# EAGLE schematic Daughter Card v7 (EAGLE 7.7.0)
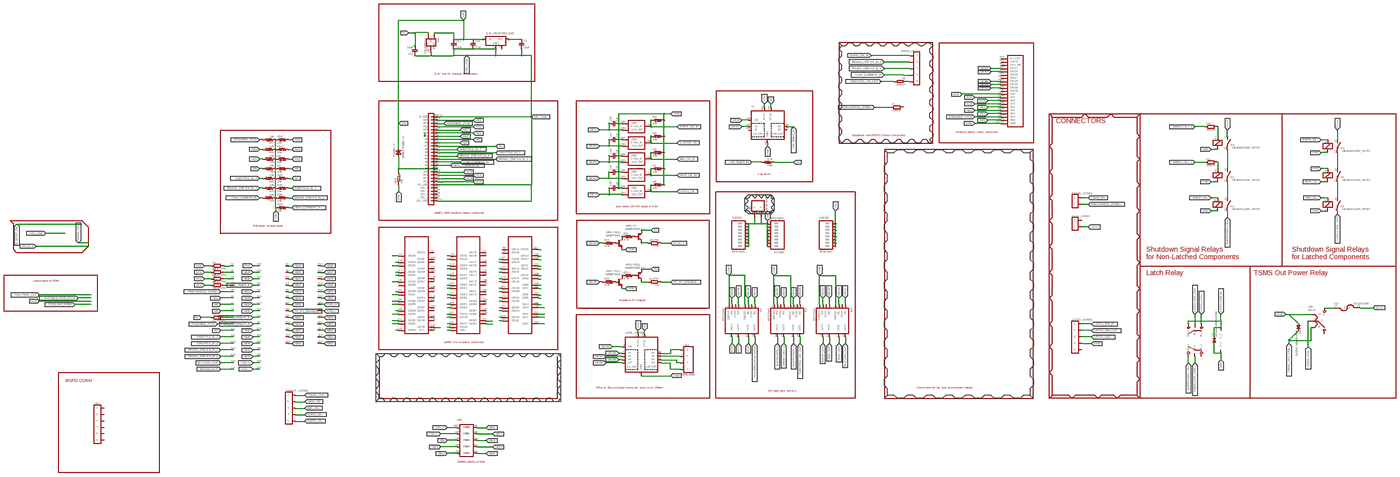
[diagram p0: schematic, sheet 1, overview]
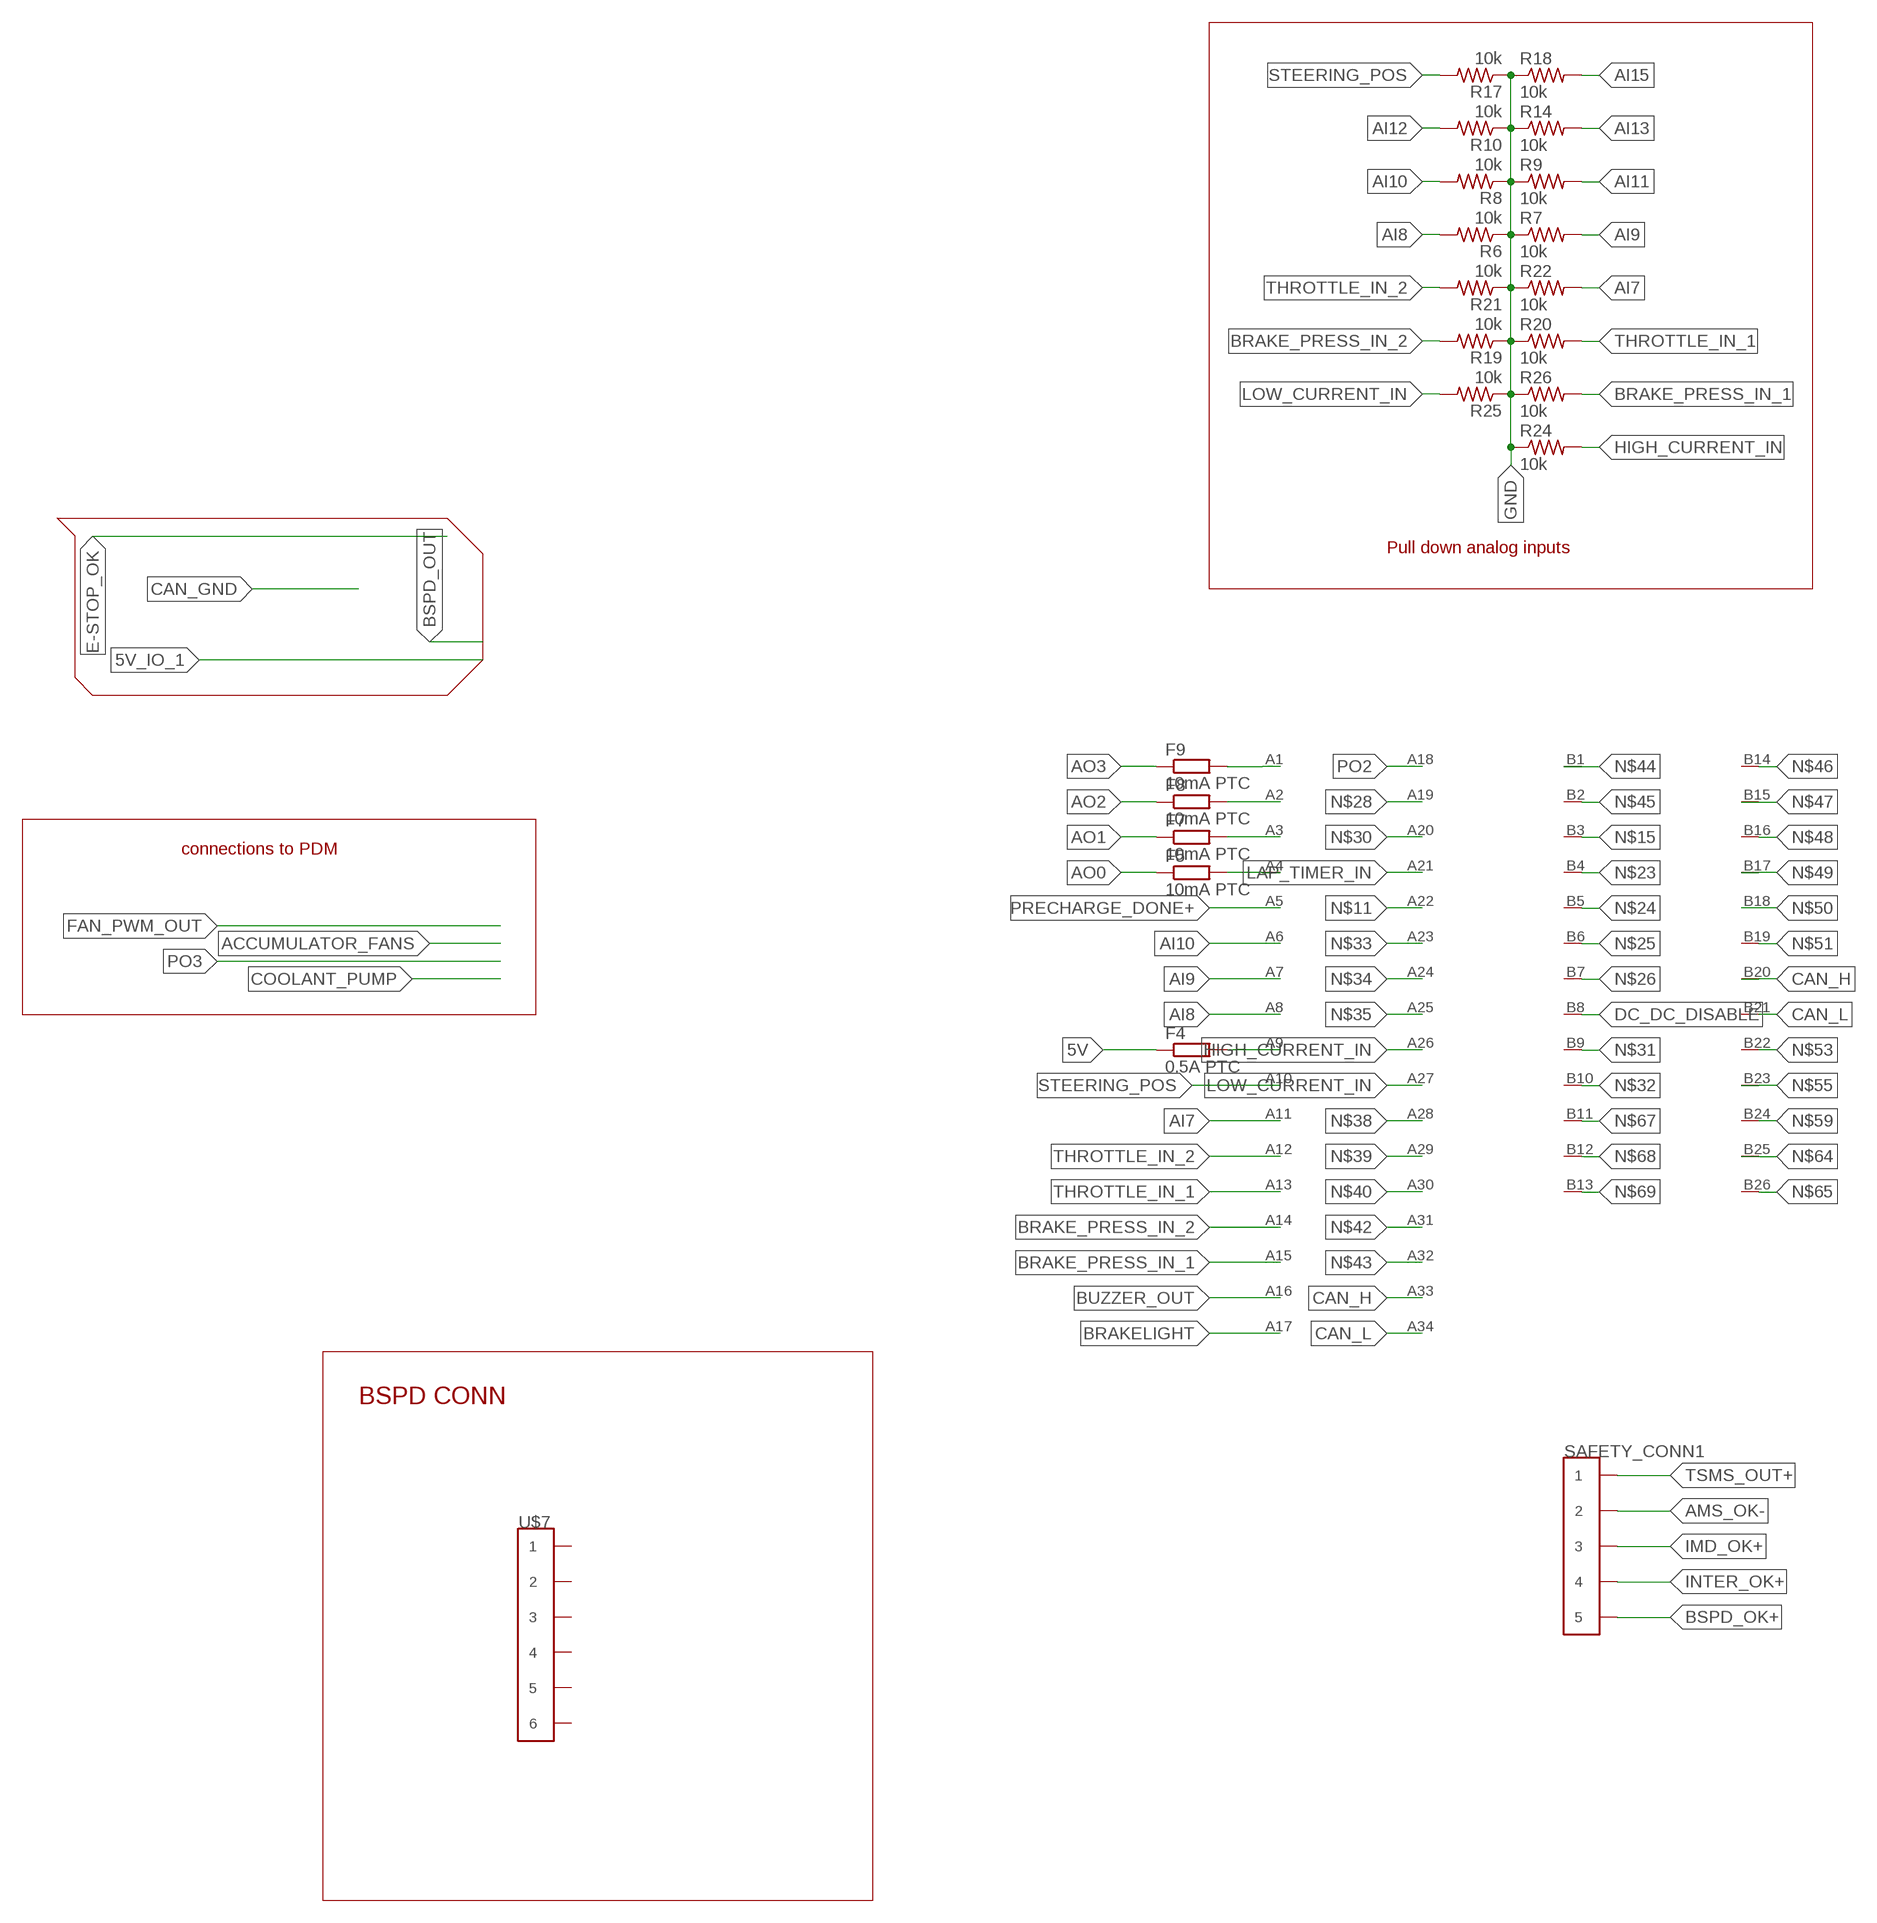
[diagram p1: schematic, sheet 1, part 1 of 4]
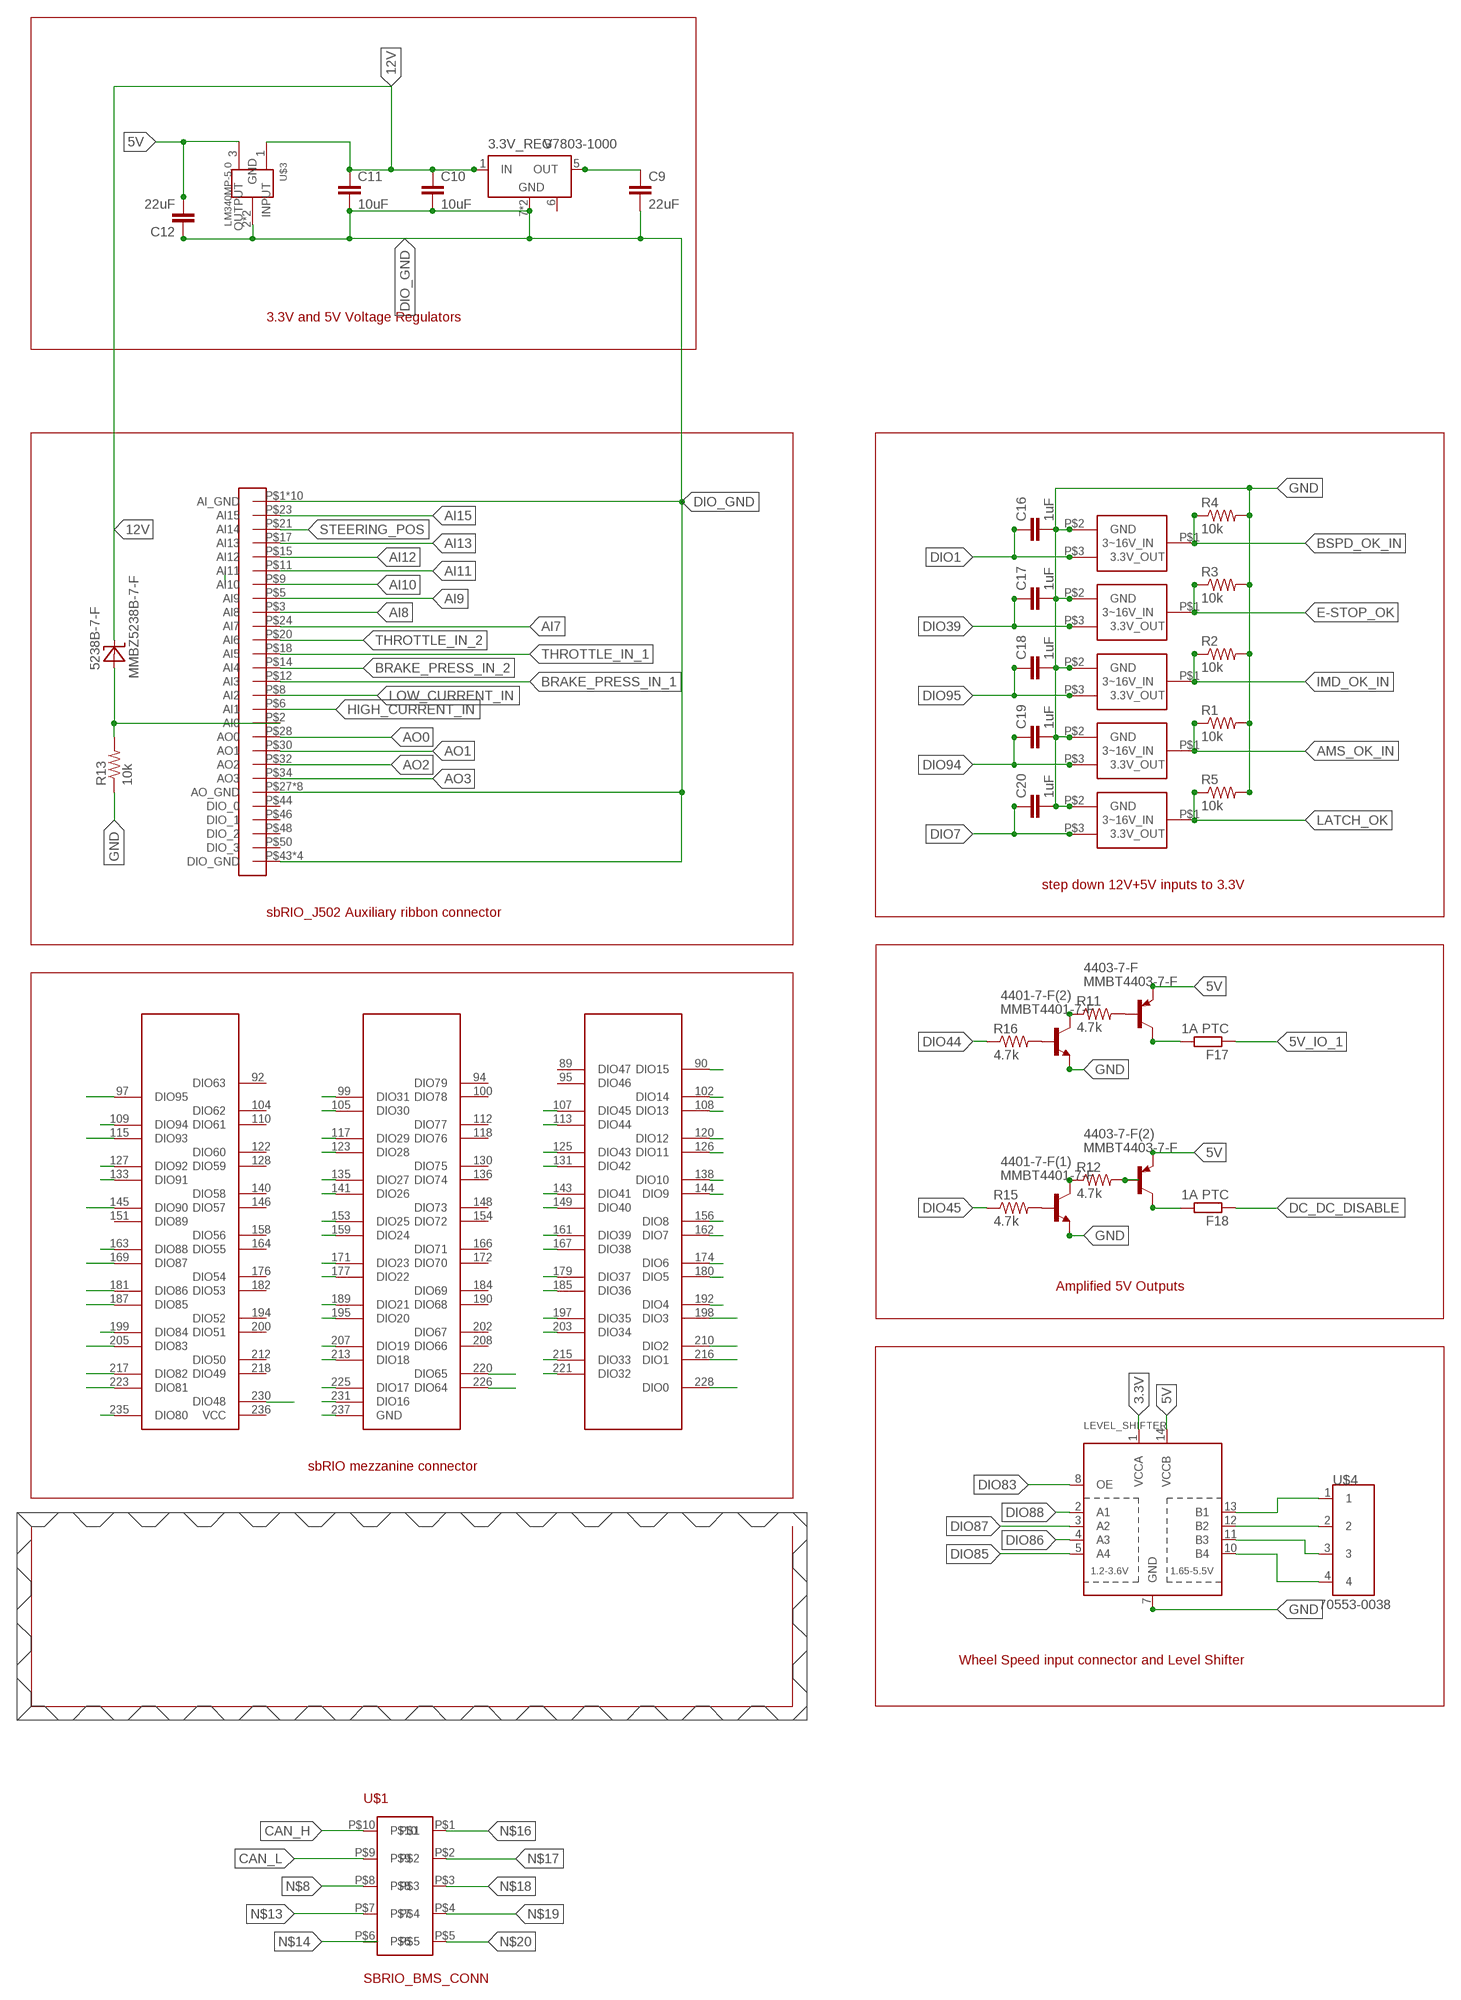
[diagram p2: schematic, sheet 1, part 2 of 4]
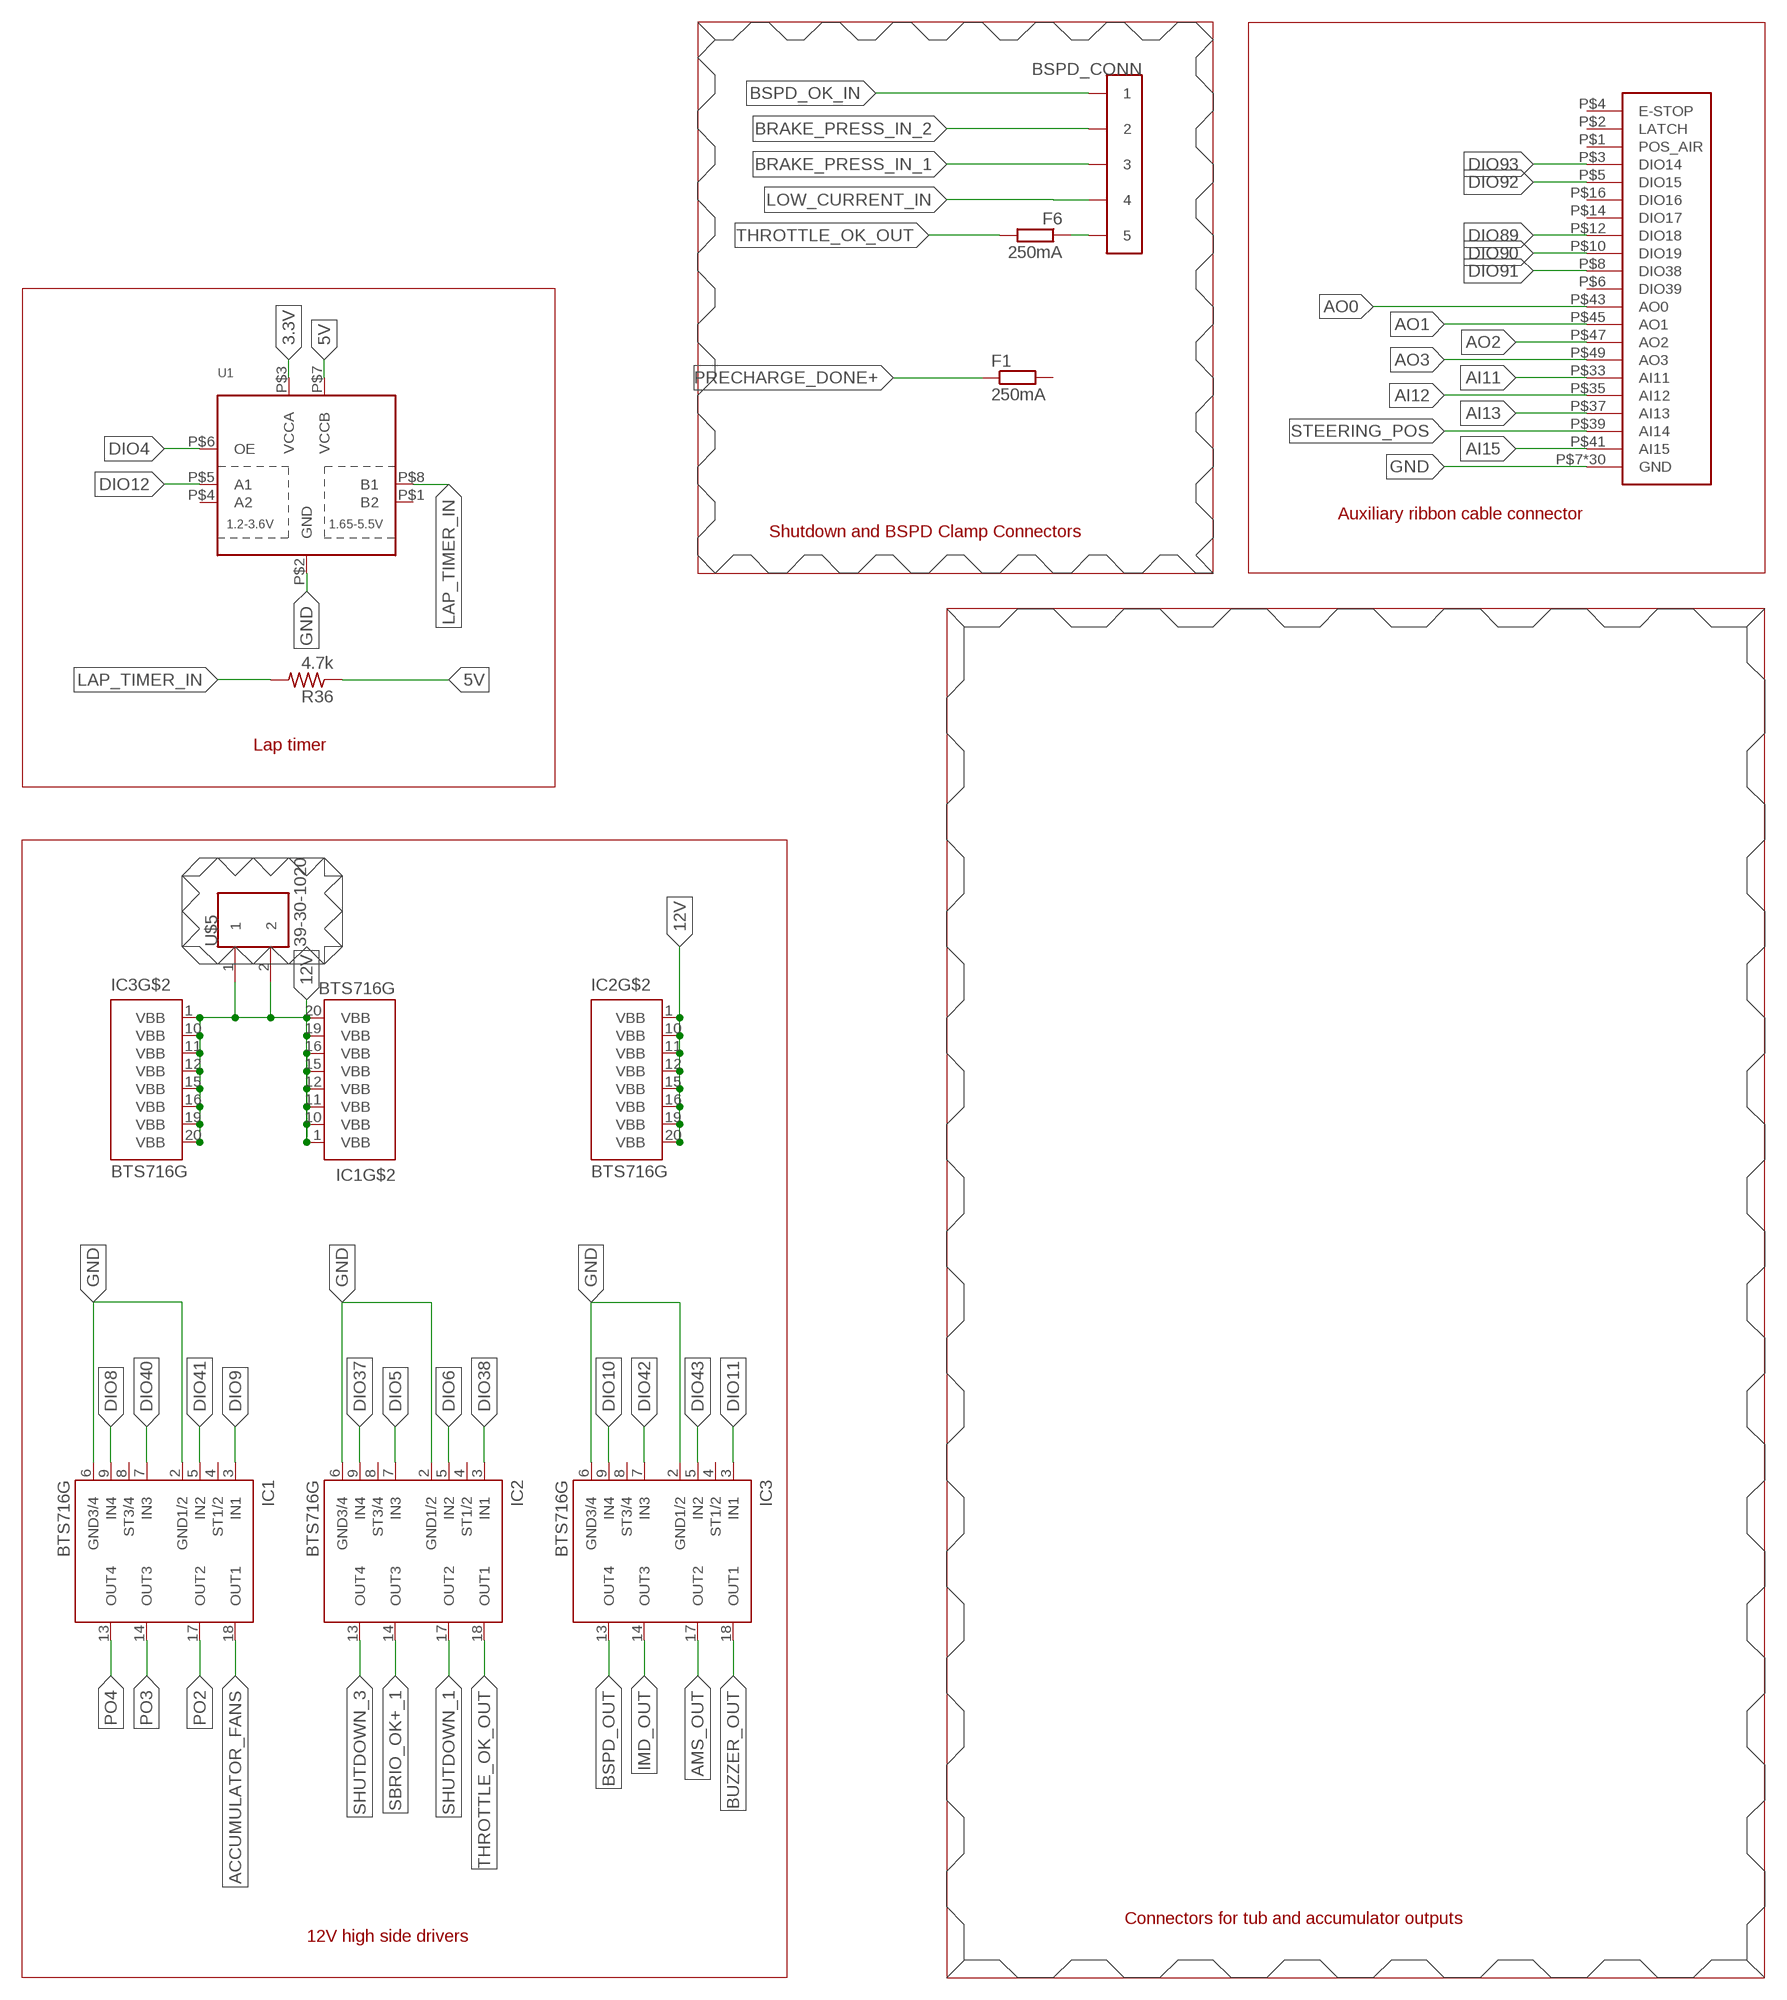
[diagram p3: schematic, sheet 1, part 3 of 4]
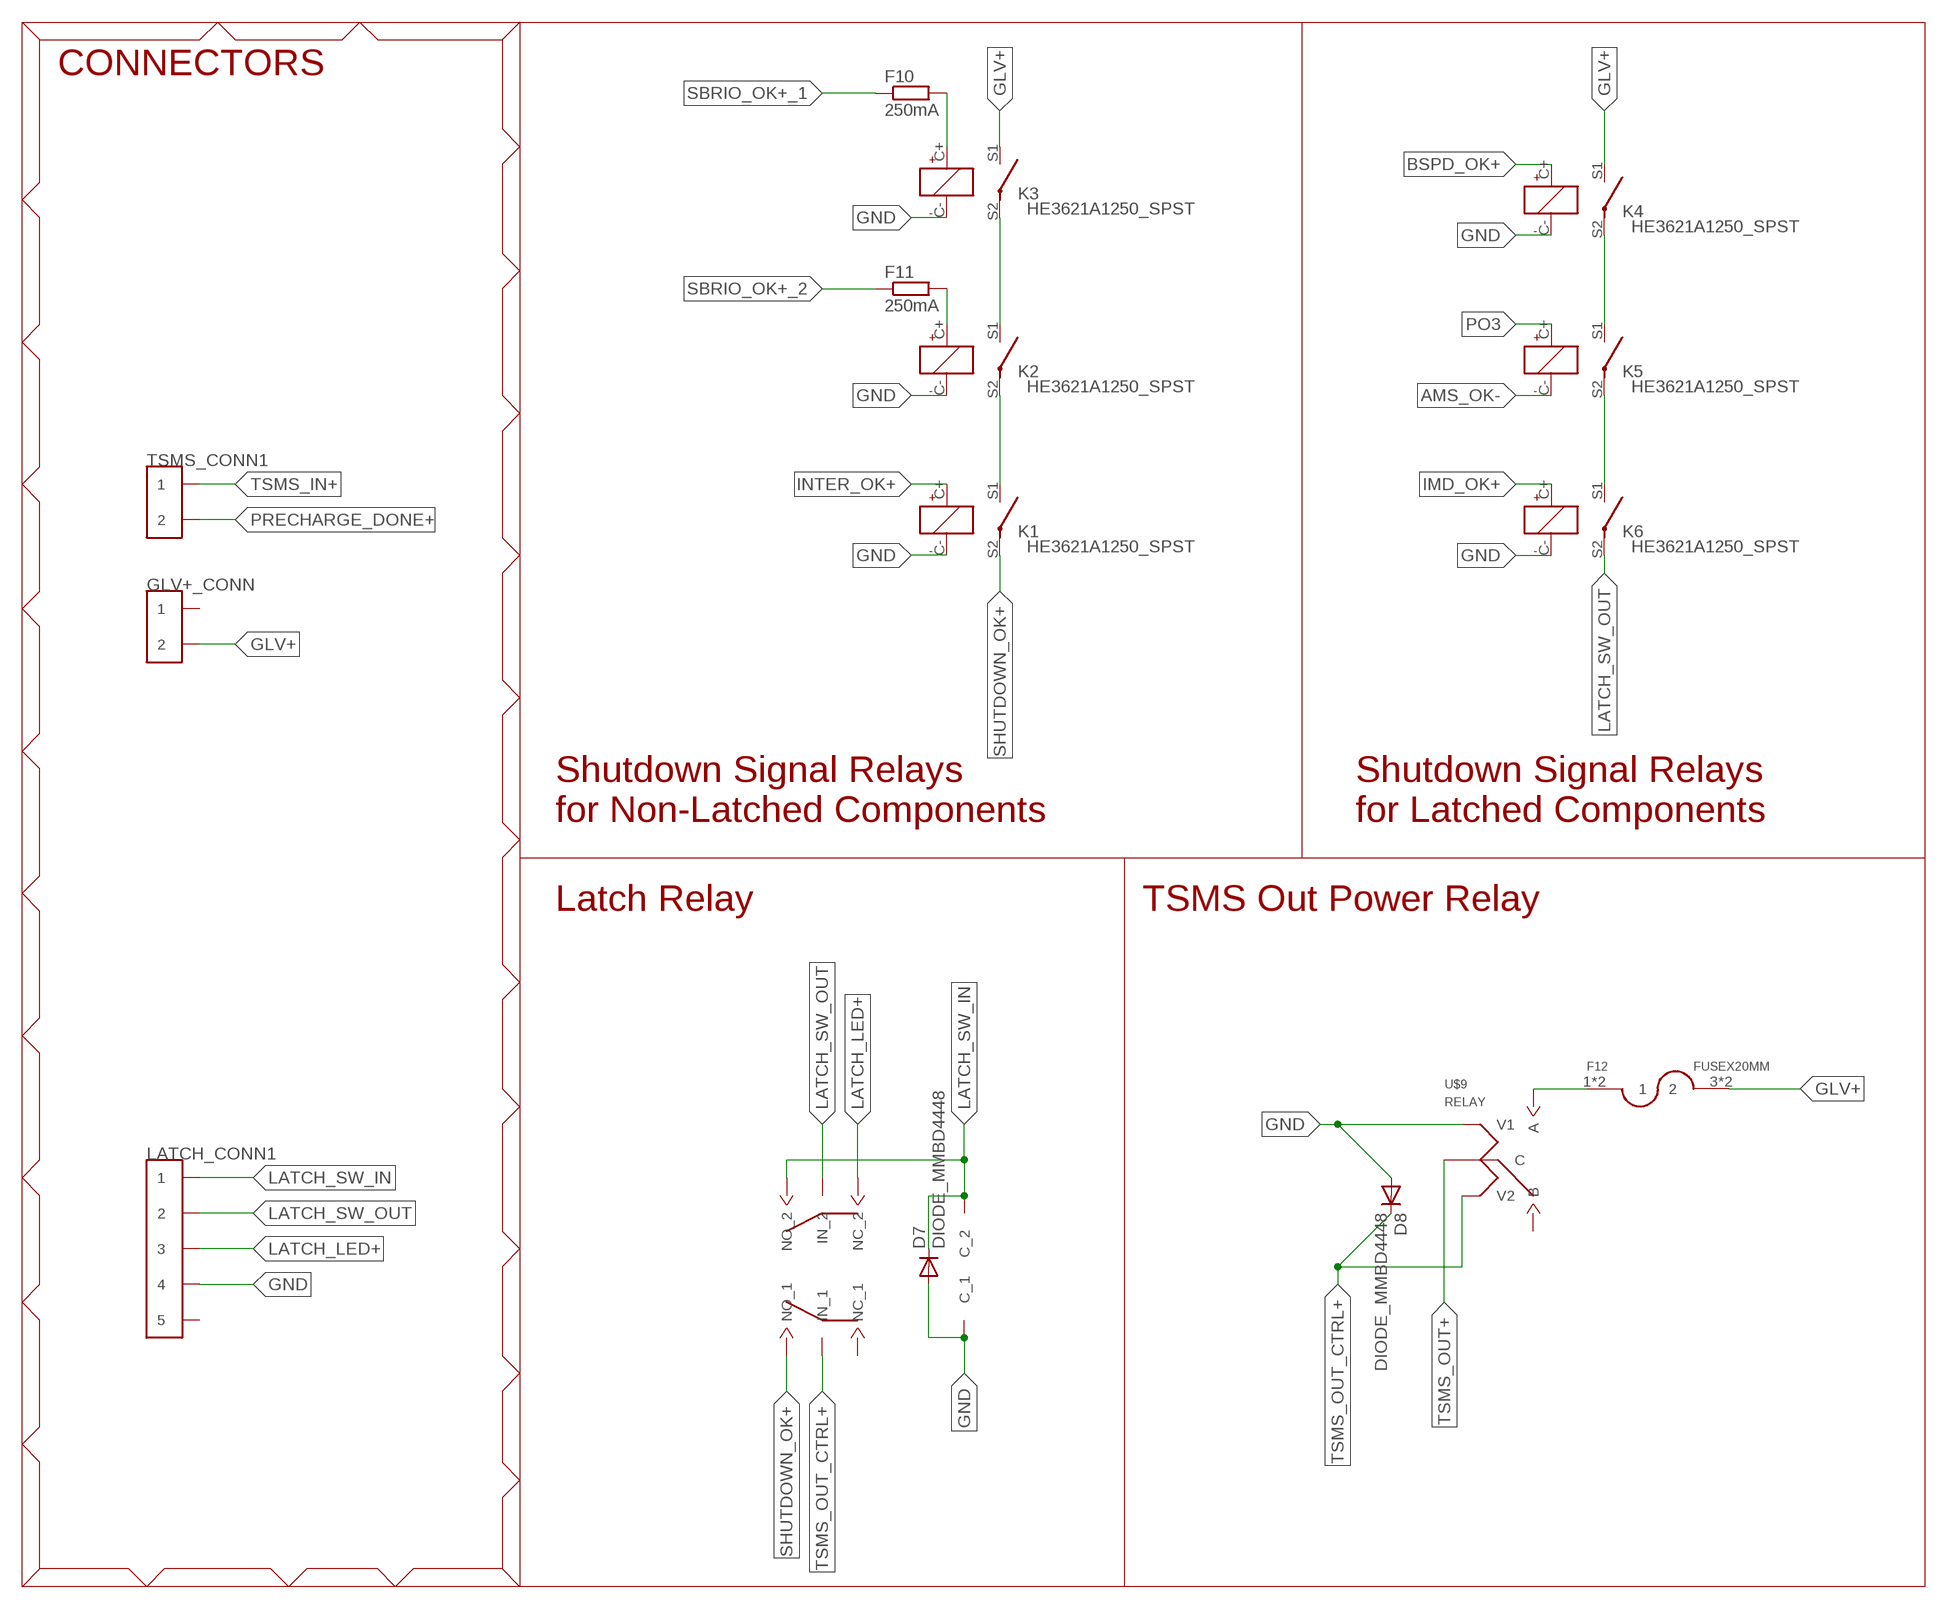
[diagram p4: schematic, sheet 1, part 4 of 4]

## Parts
3.3V_REG  V7803-1000  [V78XX-1000]
4401-7-F(1)  MMBT4401-7-F  [SOT-23-3@1]
4401-7-F(2)  MMBT4401-7-F  [SOT-23-3@1]
4403-7-F  MMBT4403-7-F  [SOT-23-3@1]
4403-7-F(2)  MMBT4403-7-F  [SOT-23-3@1]
5225-3.3M5-TR(5)  MIC5225-3.3YM5-TR  [SOT-23-3@1]
5238B-7-F  MMBZ5238B-7-F  [SOT-23-3@1]
5525-3.3YM5-TR(1)  MIC5225-3.3YM5-TR  [SOT-23-3@1]
5525-3.3YM5-TR(2)  MIC5225-3.3YM5-TR  [SOT-23-3@1]
5525-3.3YM5-TR(3)  MIC5225-3.3YM5-TR  [SOT-23-3@1]
5525-3.3YM5-TR(4)  MIC5225-3.3YM5-TR  [SOT-23-3@1]
BSPD_CONN  CONN_5  [CONNECTOR_5]
C9  22uF  CAP0603-CAP  [0603-CAP]
C10  10uF  CAP0603-CAP  [0603-CAP]
C11  10uF  CAP0603-CAP  [0603-CAP]
C12  22uF  CAP0603-CAP  [0603-CAP]
C16  1uF  CAP0603-CAP  [0603-CAP]
C17  1uF  CAP0603-CAP  [0603-CAP]
C18  1uF  CAP0603-CAP  [0603-CAP]
C19  1uF  CAP0603-CAP  [0603-CAP]
C20  1uF  CAP0603-CAP  [0603-CAP]
D7  DIODE_MMBD4448  [SOT-23-3]
D8  DIODE_MMBD4448  [SOT-23-3]
F1  250mA  R-EU_R0603  [R0603]
F4  0.5A PTC  R-EU_R0603  [R0603]
F5  10mA PTC  R-EU_R0402  [R0402]
F6  250mA  R-EU_R0603  [R0603]
F7  10mA PTC  R-EU_R0402  [R0402]
F8  10mA PTC  R-EU_R0402  [R0402]
F9  10mA PTC  R-EU_R0402  [R0402]
F10  250mA  R-EU_R0603  [R0603]
F11  250mA  R-EU_R0603  [R0603]
F12  FUSEX20MM  [FUSE_5MM]
F17  1A PTC  R-EU_R0603  [R0603]
F18  1A PTC  R-EU_R0603  [R0603]
GLV+_CONN  CONN_2  [CONNECTOR_2]
IC1  BTS716G  [PG-DSO-20]
IC2  BTS716G  [PG-DSO-20]
IC3  BTS716G  [PG-DSO-20]
K1  HE3621A1250_SPST  [HE3621A1250_SPST]
K2  HE3621A1250_SPST  [HE3621A1250_SPST]
K3  HE3621A1250_SPST  [HE3621A1250_SPST]
K4  HE3621A1250_SPST  [HE3621A1250_SPST]
K5  HE3621A1250_SPST  [HE3621A1250_SPST]
K6  HE3621A1250_SPST  [HE3621A1250_SPST]
LATCH_CONN1  CONN_5  [CONNECTOR_5]
LATCH_U1  JW2SN-DC12V  [DPDT_JW2_FORM_C]
LEVEL_SHIFTER  TXB0104PWR  [TSSOP14]
R1  10k  R-US_R0402  [R0402]
R2  10k  R-US_R0402  [R0402]
R3  10k  R-US_R0402  [R0402]
R4  10k  R-US_R0402  [R0402]
R5  10k  R-US_R0402  [R0402]
R6  10k  R-US_R0402  [R0402]
R7  10k  R-US_R0402  [R0402]
R8  10k  R-US_R0402  [R0402]
R9  10k  R-US_R0402  [R0402]
R10  10k  R-US_R0402  [R0402]
R11  4.7k  R-US_R0402  [R0402]
R12  4.7k  R-US_R0402  [R0402]
R13  10k  R-US_R0402  [R0402]
R14  10k  R-US_R0402  [R0402]
R15  4.7k  R-US_R0402  [R0402]
R16  4.7k  R-US_R0402  [R0402]
R17  10k  R-US_R0402  [R0402]
R18  10k  R-US_R0402  [R0402]
R19  10k  R-US_R0402  [R0402]
R20  10k  R-US_R0402  [R0402]
R21  10k  R-US_R0402  [R0402]
R22  10k  R-US_R0402  [R0402]
R24  10k  R-US_R0402  [R0402]
R25  10k  R-US_R0402  [R0402]
R26  10k  R-US_R0402  [R0402]
R36  4.7k  R-US_R0402  [R0402]
SAFETY_CONN1  CONN_5  [CONNECTOR_5]
SBRIO_ANALOG  SBRIO_MIO  [SBRIO_J502_J503]
SBRIO_AUX  SBRIO_AUX  [SBRIO_J502_J503]
SBRIO_MEZZANINE  SBRIO_RMC  [SEAM-40-XX.X-XX-06-X-A]
TSMS_CONN1  CONN_2  [CONNECTOR_2]
U1  TXS0102  [VFSOP-8]
U$1  SBRIO_BMS_CONN  [SBRIO_W]
U$3  LM340MP-5.0  [SOT223-4]
U$4  70553-0038  [MOLEX_70553-0038]
U$5  39-30-1020  [MOLEX_39-30-1020]
U$6  SUPERSEAL1.0_60POS  [SUPERSEAL1.0_60POS]
U$7  SULLINS_1MM_6P_HEADER  [SULLINS_1MM_HEADER]
U$9  RELAY  [RELAY]

## Nets
3.3V: LEVEL_SHIFTER.1(VCCA) U1.P$3(VCCA)
5V: 4403-7-F(2).P$3(E) 4403-7-F.P$3(E) C12.2 F4.1 LEVEL_SHIFTER.14(VCCB) R36.1 U1.P$7(VCCB) U$3.3(OUTPUT)
5V_IO_1: F17.1
12V: 3.3V_REG.1(IN) 5238B-7-F.P$1(C) C10.1 C11.1 IC1.1(VBB) IC1.10(VBB) IC1.11(VBB) IC1.12(VBB) IC1.15(VBB) IC1.16(VBB) IC1.19(VBB) IC1.20(VBB) IC2.1(VBB) IC2.10(VBB) IC2.11(VBB) IC2.12(VBB) IC2.15(VBB) IC2.16(VBB) IC2.19(VBB) IC2.20(VBB) IC3.1(VBB) IC3.10(VBB) IC3.11(VBB) IC3.12(VBB) IC3.15(VBB) IC3.16(VBB) IC3.19(VBB) IC3.20(VBB) U$3.1(INPUT) U$5.1 U$5.2
ACCUMULATOR_FANS: IC1.18(OUT1)
AI7: R22.2 SBRIO_ANALOG.P$24(AI7) U$6.A11
AI8: R6.2 SBRIO_ANALOG.P$3(AI8) U$6.A8
AI9: R7.2 SBRIO_ANALOG.P$5(AI9) U$6.A7
AI10: R8.2 SBRIO_ANALOG.P$9(AI10) U$6.A6
AI11: R9.2 SBRIO_ANALOG.P$11(AI11) SBRIO_AUX.P$33(AI11)
AI12: R10.2 SBRIO_ANALOG.P$15(AI12) SBRIO_AUX.P$35(AI12)
AI13: R14.2 SBRIO_ANALOG.P$17(AI13) SBRIO_AUX.P$37(AI13)
AI15: R18.2 SBRIO_ANALOG.P$23(AI15) SBRIO_AUX.P$41(AI15)
AMS_OK-: K5.C- SAFETY_CONN1.3 SAFETY_CONN1.4
AMS_OK_IN: 5525-3.3YM5-TR(1).P$1(3~16V_IN) R1.1
AMS_OUT: IC3.17(OUT2)
AO0: F5.1 SBRIO_ANALOG.P$28(AO0) SBRIO_AUX.P$43(AO0)
AO1: F7.1 SBRIO_ANALOG.P$30(AO1) SBRIO_AUX.P$45(AO1)
AO2: F8.1 SBRIO_ANALOG.P$32(AO2) SBRIO_AUX.P$47(AO2)
AO3: F9.1 SBRIO_ANALOG.P$34(AO3) SBRIO_AUX.P$49(AO3)
BRAKE_PRESS_IN_1: BSPD_CONN.5 BSPD_CONN.6 R26.2 SBRIO_ANALOG.P$12(AI3) U$6.A15
BRAKE_PRESS_IN_2: BSPD_CONN.3 BSPD_CONN.4 R19.2 SBRIO_ANALOG.P$14(AI4) U$6.A14
BRAKELIGHT: U$6.A17
BSPD_OK+: K4.C+ SAFETY_CONN1.9 SAFETY_CONN1.10
BSPD_OK_IN: 5525-3.3YM5-TR(3).P$1(3~16V_IN) BSPD_CONN.1 BSPD_CONN.2 R4.1
BSPD_OUT: IC3.13(OUT4)
BUZZER_OUT: IC3.18(OUT1) U$6.A16
CAN_H: U$1.P$10 U$6.A33 U$6.B20
CAN_L: U$1.P$9 U$6.A34 U$6.B21
DC_DC_DISABLE: F18.1 U$6.B8
DIO0: SBRIO_MEZZANINE.228(DIO0)
DIO1: 5525-3.3YM5-TR(3).P$3(3.3V_OUT) C16.1 SBRIO_MEZZANINE.216(DIO1)
DIO2: SBRIO_MEZZANINE.210(DIO2)
DIO3: SBRIO_MEZZANINE.198(DIO3)
DIO4: SBRIO_MEZZANINE.192(DIO4) U1.P$6(OE)
DIO5: IC2.7(IN3) SBRIO_MEZZANINE.180(DIO5)
DIO6: IC2.5(IN2) SBRIO_MEZZANINE.174(DIO6)
DIO7: 5525-3.3YM5-TR(2).P$3(3.3V_OUT) C20.1 SBRIO_MEZZANINE.162(DIO7)
DIO8: IC1.9(IN4) SBRIO_MEZZANINE.156(DIO8)
DIO9: IC1.3(IN1) SBRIO_MEZZANINE.144(DIO9)
DIO10: IC3.9(IN4) SBRIO_MEZZANINE.138(DIO10)
DIO11: IC3.3(IN1) SBRIO_MEZZANINE.126(DIO11)
DIO12: SBRIO_MEZZANINE.120(DIO12) U1.P$5(A1)
DIO13: SBRIO_MEZZANINE.108(DIO13)
DIO14: SBRIO_MEZZANINE.102(DIO14)
DIO15: SBRIO_MEZZANINE.90(DIO15)
DIO16: SBRIO_MEZZANINE.231(DIO16)
DIO17: SBRIO_MEZZANINE.225(DIO17)
DIO18: SBRIO_MEZZANINE.213(DIO18)
DIO19: SBRIO_MEZZANINE.207(DIO19)
DIO20: SBRIO_MEZZANINE.195(DIO20)
DIO21: SBRIO_MEZZANINE.189(DIO21)
DIO22: SBRIO_MEZZANINE.177(DIO22)
DIO23: SBRIO_MEZZANINE.171(DIO23)
DIO24: SBRIO_MEZZANINE.159(DIO24)
DIO25: SBRIO_MEZZANINE.153(DIO25)
DIO26: SBRIO_MEZZANINE.141(DIO26)
DIO27: SBRIO_MEZZANINE.135(DIO27)
DIO28: SBRIO_MEZZANINE.123(DIO28)
DIO29: SBRIO_MEZZANINE.117(DIO29)
DIO30: SBRIO_MEZZANINE.105(DIO30)
DIO31: SBRIO_MEZZANINE.99(DIO31)
DIO32: SBRIO_MEZZANINE.221(DIO32)
DIO33: SBRIO_MEZZANINE.215(DIO33)
DIO34: SBRIO_MEZZANINE.203(DIO34)
DIO35: SBRIO_MEZZANINE.197(DIO35)
DIO36: SBRIO_MEZZANINE.185(DIO36)
DIO37: IC2.9(IN4) SBRIO_MEZZANINE.179(DIO37)
DIO38: IC2.3(IN1) SBRIO_MEZZANINE.167(DIO38)
DIO39: 5525-3.3YM5-TR(4).P$3(3.3V_OUT) C17.1 SBRIO_MEZZANINE.161(DIO39)
DIO40: IC1.7(IN3) SBRIO_MEZZANINE.149(DIO40)
DIO41: IC1.5(IN2) SBRIO_MEZZANINE.143(DIO41)
DIO42: IC3.7(IN3) SBRIO_MEZZANINE.131(DIO42)
DIO43: IC3.5(IN2) SBRIO_MEZZANINE.125(DIO43)
DIO44: R16.1 SBRIO_MEZZANINE.113(DIO44)
DIO45: R15.1 SBRIO_MEZZANINE.107(DIO45)
DIO48: SBRIO_MEZZANINE.230(DIO48)
DIO64: SBRIO_MEZZANINE.226(DIO64)
DIO65: SBRIO_MEZZANINE.220(DIO65)
DIO80: SBRIO_MEZZANINE.235(DIO80)
DIO81: SBRIO_MEZZANINE.223(DIO81)
DIO82: SBRIO_MEZZANINE.217(DIO82)
DIO83: LEVEL_SHIFTER.8(OE) SBRIO_MEZZANINE.205(DIO83)
DIO84: SBRIO_MEZZANINE.199(DIO84)
DIO85: LEVEL_SHIFTER.5(A4) SBRIO_MEZZANINE.187(DIO85)
DIO86: LEVEL_SHIFTER.4(A3) SBRIO_MEZZANINE.181(DIO86)
DIO87: LEVEL_SHIFTER.3(A2) SBRIO_MEZZANINE.169(DIO87)
DIO88: LEVEL_SHIFTER.2(A1) SBRIO_MEZZANINE.163(DIO88)
DIO89: SBRIO_AUX.P$12(DIO18)
DIO90: SBRIO_AUX.P$10(DIO19) SBRIO_MEZZANINE.145(DIO90)
DIO91: SBRIO_AUX.P$8(DIO38) SBRIO_MEZZANINE.133(DIO91)
DIO92: SBRIO_AUX.P$5(DIO15) SBRIO_MEZZANINE.127(DIO92)
DIO93: SBRIO_AUX.P$3(DIO14) SBRIO_MEZZANINE.115(DIO93)
DIO94: 5525-3.3YM5-TR(1).P$3(3.3V_OUT) C19.1 SBRIO_MEZZANINE.109(DIO94)
DIO95: 5225-3.3M5-TR(5).P$3(3.3V_OUT) C18.1 SBRIO_MEZZANINE.97(DIO95)
DIO_GND: 3.3V_REG.7(GND) 3.3V_REG.9(GND) C9.2 C10.2 C11.2 C12.1 SBRIO_ANALOG.P$1(AI_GND) SBRIO_ANALOG.P$4(AI_GND) SBRIO_ANALOG.P$7(AI_GND) SBRIO_ANALOG.P$10(AI_GND) SBRIO_ANALOG.P$13(AI_GND) SBRIO_ANALOG.P$16(AI_GND) SBRIO_ANALOG.P$19(AI_GND) SBRIO_ANALOG.P$22(AI_GND) SBRIO_ANALOG.P$25(AI_GND) SBRIO_ANALOG.P$26(AI_GND) SBRIO_ANALOG.P$27(AO_GND) SBRIO_ANALOG.P$29(AO_GND) SBRIO_ANALOG.P$31(AO_GND) SBRIO_ANALOG.P$33(AO_GND) SBRIO_ANALOG.P$35(AO_GND) SBRIO_ANALOG.P$37(AO_GND) SBRIO_ANALOG.P$39(AO_GND) SBRIO_ANALOG.P$41(AO_GND) SBRIO_ANALOG.P$43(DIO_GND) SBRIO_ANALOG.P$45(DIO_GND) SBRIO_ANALOG.P$47(DIO_GND) SBRIO_ANALOG.P$49(DIO_GND) U$3.2(GND) U$3.4(GND)
E-STOP_OK: 5525-3.3YM5-TR(4).P$1(3~16V_IN) R3.1
GLV+: F12.3 F12.4 GLV+_CONN.3 GLV+_CONN.4 K3.S1(SW_1) K4.S1(SW_1)
GND: 4401-7-F(1).P$3(E) 4401-7-F(2).P$3(E) 5225-3.3M5-TR(5).P$2(GND) 5525-3.3YM5-TR(1).P$2(GND) 5525-3.3YM5-TR(2).P$2(GND) 5525-3.3YM5-TR(3).P$2(GND) 5525-3.3YM5-TR(4).P$2(GND) C16.2 C17.2 C18.2 C19.2 C20.2 D7.P$2(A) D8.P$2(A) IC1.2(GND1/2) IC1.6(GND3/4) IC2.2(GND1/2) IC2.6(GND3/4) IC3.2(GND1/2) IC3.6(GND3/4) K1.C- K2.C- K3.C- K4.C- K6.C- LATCH_CONN1.7 LATCH_CONN1.8 LATCH_U1.COIL_1(C_1) LEVEL_SHIFTER.7(GND) R1.2 R2.2 R3.2 R4.2 R5.2 R6.1 R7.1 R8.1 R9.1 R10.1 R13.1 R14.1 R17.1 R18.1 R19.1 R20.1 R21.1 R22.1 R24.1 R25.1 R26.1 SBRIO_AUX.P$7(GND) SBRIO_AUX.P$9(GND) SBRIO_AUX.P$11(GND) SBRIO_AUX.P$13(GND) SBRIO_AUX.P$15(GND) SBRIO_AUX.P$17(GND) SBRIO_AUX.P$18(GND) SBRIO_AUX.P$19(GND) SBRIO_AUX.P$20(GND) SBRIO_AUX.P$21(GND) SBRIO_AUX.P$22(GND) SBRIO_AUX.P$23(GND) SBRIO_AUX.P$24(GND) SBRIO_AUX.P$25(GND) SBRIO_AUX.P$26(GND) SBRIO_AUX.P$27(GND) SBRIO_AUX.P$28(GND) SBRIO_AUX.P$29(GND) SBRIO_AUX.P$30(GND) SBRIO_AUX.P$31(GND) SBRIO_AUX.P$32(GND) SBRIO_AUX.P$34(GND) SBRIO_AUX.P$36(GND) SBRIO_AUX.P$38(GND) SBRIO_AUX.P$40(GND) SBRIO_AUX.P$42(GND) SBRIO_AUX.P$44(GND) SBRIO_AUX.P$46(GND) SBRIO_AUX.P$48(GND) SBRIO_AUX.P$50(GND) SBRIO_MEZZANINE.237(GND) U1.P$2(GND) U$9.V1
HIGH_CURRENT_IN: R24.2 SBRIO_ANALOG.P$6(AI1) U$6.A26
IMD_OK+: K6.C+ SAFETY_CONN1.5 SAFETY_CONN1.6
IMD_OK_IN: 5225-3.3M5-TR(5).P$1(3~16V_IN) R2.1
IMD_OUT: IC3.14(OUT3)
INTER_OK+: K1.C+ SAFETY_CONN1.7 SAFETY_CONN1.8
K4: K4.S2(SW_2) K5.S1(SW_1)
LAP_TIMER_IN: R36.2 U1.P$8(B1) U$6.A21
LATCH_LED+: LATCH_CONN1.5 LATCH_CONN1.6 LATCH_U1.NC_2
LATCH_OK: 5525-3.3YM5-TR(2).P$1(3~16V_IN) R5.1
LATCH_SW_IN: D7.P$1(C) LATCH_CONN1.1 LATCH_CONN1.2 LATCH_U1.COIL_2(C_2) LATCH_U1.NO_2
LATCH_SW_OUT: K6.S2(SW_2) LATCH_CONN1.3 LATCH_CONN1.4 LATCH_U1.CENTER_2(IN_2)
LOW_CURRENT_IN: BSPD_CONN.7 BSPD_CONN.8 R25.2 SBRIO_ANALOG.P$8(AI2) U$6.A27
N$3: K2.S1(SW_1) K3.S2(SW_2)
N$4: 5238B-7-F.P$2(A) R13.2 SBRIO_ANALOG.P$2(AI0)
N$5: 3.3V_REG.5(OUT) C9.1
N$6: K1.S1(SW_1) K2.S2(SW_2)
N$8: U$1.P$8
N$9: K5.S2(SW_2) K6.S1(SW_1)
N$10: F12.1 F12.2 U$9.A
N$11: U$6.A22
N$12: F4.2 U$6.A9
N$13: U$1.P$7
N$15: U$6.B3
N$16: U$1.P$1
N$17: U$1.P$2
N$18: U$1.P$3
N$19: U$1.P$4
N$20: U$1.P$5
N$23: U$6.B4
N$24: U$6.B5
N$25: U$6.B6
N$26: U$6.B7
N$28: U$6.A19
N$30: U$6.A20
N$31: U$6.B9
N$32: U$6.B10
N$33: U$6.A23
N$34: U$6.A24
N$35: U$6.A25
N$38: U$6.A28
N$39: U$6.A29
N$40: U$6.A30
N$41: BSPD_CONN.9 BSPD_CONN.10 F6.1
N$42: U$6.A31
N$43: U$6.A32
N$45: U$6.B2
N$46: U$6.B14
N$47: U$6.B15
N$48: U$6.B16
N$49: U$6.B17
N$50: U$6.B18
N$51: U$6.B19
N$53: U$6.B22
N$54: 4403-7-F.P$2(B) R11.2
N$55: U$6.B23
N$56: 4403-7-F.P$1(C) F17.2
N$57: 4403-7-F(2).P$1(C) F18.2
N$58: 4403-7-F(2).P$2(B) R12.2
N$59: U$6.B24
N$60: 4401-7-F(1).P$2(B) R15.2
N$61: 4401-7-F(1).P$1(C) R12.1
N$62: 4401-7-F(2).P$2(B) R16.2
N$63: 4401-7-F(2).P$1(C) R11.1
N$65: U$6.B26
N$67: U$6.B11
N$68: U$6.B12
N$69: U$6.B13
N$70: F5.2 U$6.A4
N$71: F7.2 U$6.A3
N$72: F8.2 U$6.A2
N$73: F9.2 U$6.A1
PO2: IC1.17(OUT2) U$6.A18
PO3: IC1.14(OUT3) K5.C+
PO4: IC1.13(OUT4)
PRECHARGE_DONE+: F1.1 TSMS_CONN1.3 TSMS_CONN1.4 U$6.A5
SBRIO_OK+_1: F10.1 IC2.14(OUT3)
SBRIO_OK+_1_RELAY_IN1: F10.2 K3.C+
SBRIO_OK+_2: F11.1
SBRIO_OK_2_RELAY1: F11.2 K2.C+
SHUTDOWN_1: IC2.17(OUT2)
SHUTDOWN_3: IC2.13(OUT4)
SHUTDOWN_OK+: K1.S2(SW_2) LATCH_U1.NO_1
STEERING_POS: R17.2 SBRIO_ANALOG.P$21(AI14) SBRIO_AUX.P$39(AI14) U$6.A10
THROTTLE_IN_1: R20.2 SBRIO_ANALOG.P$18(AI5) U$6.A13
THROTTLE_IN_2: R21.2 SBRIO_ANALOG.P$20(AI6) U$6.A12
THROTTLE_OK_OUT: F6.2 IC2.18(OUT1)
TSMS_IN+: TSMS_CONN1.1 TSMS_CONN1.2
TSMS_OUT+: SAFETY_CONN1.1 SAFETY_CONN1.2 U$9.CENTER(C)
TSMS_OUT_CTRL+: D8.P$1(C) LATCH_U1.CENTER_1(IN_1) U$9.V2
WS1: LEVEL_SHIFTER.13(B1) U$4.1
WS2: LEVEL_SHIFTER.12(B2) U$4.2
WS3: LEVEL_SHIFTER.11(B3) U$4.3
WS4: LEVEL_SHIFTER.10(B4) U$4.4
Unconnected: 3.3V_REG.6 F1.2 GLV+_CONN.1 GLV+_CONN.2 IC1.4(ST1/2) IC1.8(ST3/4) IC2.4(ST1/2) IC2.8(ST3/4) IC3.4(ST1/2) IC3.8(ST3/4) LATCH_CONN1.9 LATCH_CONN1.10 LATCH_U1.NC_1 SBRIO_ANALOG.P$44(DIO_0) SBRIO_ANALOG.P$46(DIO_1) SBRIO_ANALOG.P$48(DIO_2) SBRIO_ANALOG.P$50(DIO_3) SBRIO_AUX.P$1(POS_AIR) SBRIO_AUX.P$2(LATCH) SBRIO_AUX.P$4(E-STOP) SBRIO_AUX.P$6(DIO39) SBRIO_AUX.P$14(DIO17) SBRIO_AUX.P$16(DIO16) SBRIO_MEZZANINE.89(DIO47) SBRIO_MEZZANINE.92(DIO63) SBRIO_MEZZANINE.94(DIO79) SBRIO_MEZZANINE.95(DIO46) SBRIO_MEZZANINE.100(DIO78) SBRIO_MEZZANINE.104(DIO62) SBRIO_MEZZANINE.110(DIO61) SBRIO_MEZZANINE.112(DIO77) SBRIO_MEZZANINE.118(DIO76) SBRIO_MEZZANINE.122(DIO60) SBRIO_MEZZANINE.128(DIO59) SBRIO_MEZZANINE.130(DIO75) SBRIO_MEZZANINE.136(DIO74) SBRIO_MEZZANINE.140(DIO58) SBRIO_MEZZANINE.146(DIO57) SBRIO_MEZZANINE.148(DIO73) SBRIO_MEZZANINE.151(DIO89) SBRIO_MEZZANINE.154(DIO72) SBRIO_MEZZANINE.158(DIO56) SBRIO_MEZZANINE.164(DIO55) SBRIO_MEZZANINE.166(DIO71) SBRIO_MEZZANINE.172(DIO70) SBRIO_MEZZANINE.176(DIO54) SBRIO_MEZZANINE.182(DIO53) SBRIO_MEZZANINE.184(DIO69) SBRIO_MEZZANINE.190(DIO68) SBRIO_MEZZANINE.194(DIO52) SBRIO_MEZZANINE.200(DIO51) SBRIO_MEZZANINE.202(DIO67) SBRIO_MEZZANINE.208(DIO66) SBRIO_MEZZANINE.212(DIO50) SBRIO_MEZZANINE.218(DIO49) U1.P$1(B2) U1.P$4(A2) U$1.P$6 U$6.B1 U$6.B25 U$7.P1 U$7.P2 U$7.P3 U$7.P4 U$7.P5 U$7.P6 U$9.B

## Notes on the sheet
- 3.3V and 5V Voltage Regulators
- CONNECTORS
- Auxiliary ribbon cable connector
- Shutdown and BSPD Clamp Connectors
- Lap timer
- step down 12V+5V inputs to 3.3V
- sbRIO_J502 Auxiliary ribbon connector
- Pull down analog inputs
- Shutdown Signal Relays
  for Non-Latched Components
- Shutdown Signal Relays
  for Latched Components
- Latch Relay | TSMS Out Power Relay
- connections to PDM
- Amplified 5V Outputs
- sbRIO mezzanine connector
- BSPD CONN
- Wheel Speed input connector and Level Shifter | Connectors for tub and accumulator outputs
- 12V high side drivers

## Power pins joined to a net without a drawn wire
VCC: SBRIO_MEZZANINE.236(VCC)

## Library data of the parts
3.3V_REG = formula electric:V7803-1000
4401-7-F(1) 4401-7-F(2) = formula electric:MMBT4401-7-F
4403-7-F 4403-7-F(2) = formula electric:MMBT4403-7-F
5225-3.3M5-TR(5) 5525-3.3YM5-TR(1) 5525-3.3YM5-TR(2) 5525-3.3YM5-TR(3) 5525-3.3YM5-TR(4) = formula electric:MIC5225-3.3YM5-TR: not the device name DIGIKEY PN: MCP1703T-3302E/CBCT-ND; DIGIKEYPN: MCP1703T-3302E/CBCT-ND
5238B-7-F = formula electric:MMBZ5238B-7-F: Digikey: MMBZ5238B-FDICT-ND
BSPD_CONN LATCH_CONN1 SAFETY_CONN1 = formula electric:CONN_5
C9-C12 C16-C20 = SparkFun-Passives:CAP: Capacitor Standard 0603 ceramic capacitor, and 0.1" leaded capacitor.
D7 D8 = formula electric:DIODE_MMBD4448
F1 F4-F11 F17 F18 = resistor:R-EU_: RESISTOR, European symbol
F12 = SparkFun-Passives:FUSE
GLV+_CONN TSMS_CONN1 = formula electric:CONN_2
IC1-IC3 = infineon:BTS716G: Smart High-Side Power Switch Four Channels: 4 x 140mOhm staus Feedback Source: http://www.infineon.com/dgdl/BTS716G.pdf; OC_FARNELL: unknown; OC_NEWARK: unknown
K1-K6 = formula electric:HE3621A1250_SPST
LATCH_U1 = formula electric:JW2SN-DC12V: JW2SN-DC12V, DPDT 5A 12V Coil Relay, Digikey: 255-1117-ND
LEVEL_SHIFTER = SparkFun-DigitalIC:TXB0104PWR: 4-Bit Bi-Directional Level Shifter 1.2V-3.6V (VCCA) to 1.65V-5.5V (VCCB) bi-directional level shifter with auto direction sensing. Max data rate - VCCA 1.8V: 20Mbps (50ns), VCCA 3.3V: 100Mbps (10ns) Digikey: 296-21929-1-ND (TSSOP) IC-11329
R1-R22 R24-R26 R36 = resistor:R-US_: RESISTOR, American symbol
SBRIO_ANALOG = formula electric:SBRIO_MIO
SBRIO_AUX = formula electric:SBRIO_AUX: An output for a lot of the extra pins on the sbRIO.
SBRIO_MEZZANINE = SEAM-40-XX.X-XX-06-X-A:SBRIO_RMC
U1 = adafruit:TXS0102: 2-Bit Bi-Directional Level Shifter (I2C, etc.) Designed for I2C devices and has internal pullups. Not to be confused with TXB010x series. 1.2V-3.6V (VCCA) to 1.65V-5.5V (VCCB) bi-directional level shifter with auto direction sensing. Max data rate - 24Mbps (Push Pull), 2Mbps (Open Drain) Digikey: 296-21931-1-ND
U$1 = formula electric:SBRIO_BMS_CONN
U$3 = texas:LM340MP-5.0
U$4 = molex:70553-0038
U$5 = molex:39-30-1020
U$6 = TE:SUPERSEAL1.0_60POS
U$7 = formula electric:SULLINS_1MM_6P_HEADER
U$9 = formula electric:RELAY: Digikey: PB1321-ND